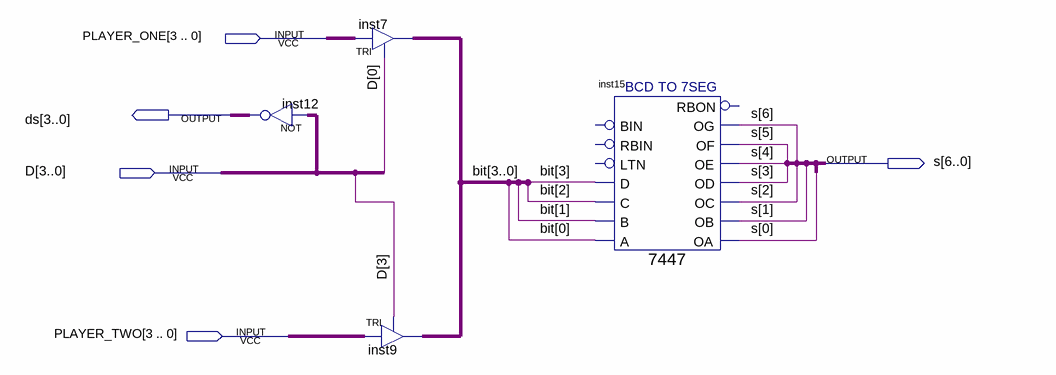
[diagram p0: schematic sheet]
// Quartus schematic seven_segment.bdf as structural Verilog: 4 symbols, 5 pins
module seven_segment (
  input  [3:0] PLAYER_ONE,
  input  [3:0] D,
  input  [3:0] PLAYER_TWO,
  output [3:0] ds,
  output [6:0] s
);

  wire [3:0] \bit ;

  assign ds = ~D;  // NOT inst12, 4 bits wide
  TRI inst7[3:0] (.IN(PLAYER_ONE), .OE(D[0]), .OUT(\bit ));
  TRI inst9[3:0] (.IN(PLAYER_TWO), .OE(D[3]), .OUT(\bit ));
  \7447  inst15 (
    .B(\bit [1]), .C(\bit [2]), .D(\bit [3]), .A(\bit [0]), .OB(s[1]), .OC(s[2]), .OE(s[4]), .OD(s[3]),
    .OF(s[5]), .OG(s[6]), .OA(s[0]));  // open: LTN, RBIN, BIN, RBON
endmodule
